# Altium schematic sheet connections.SchDoc
size A4; SheetNumber: 4; SheetTotal: 4
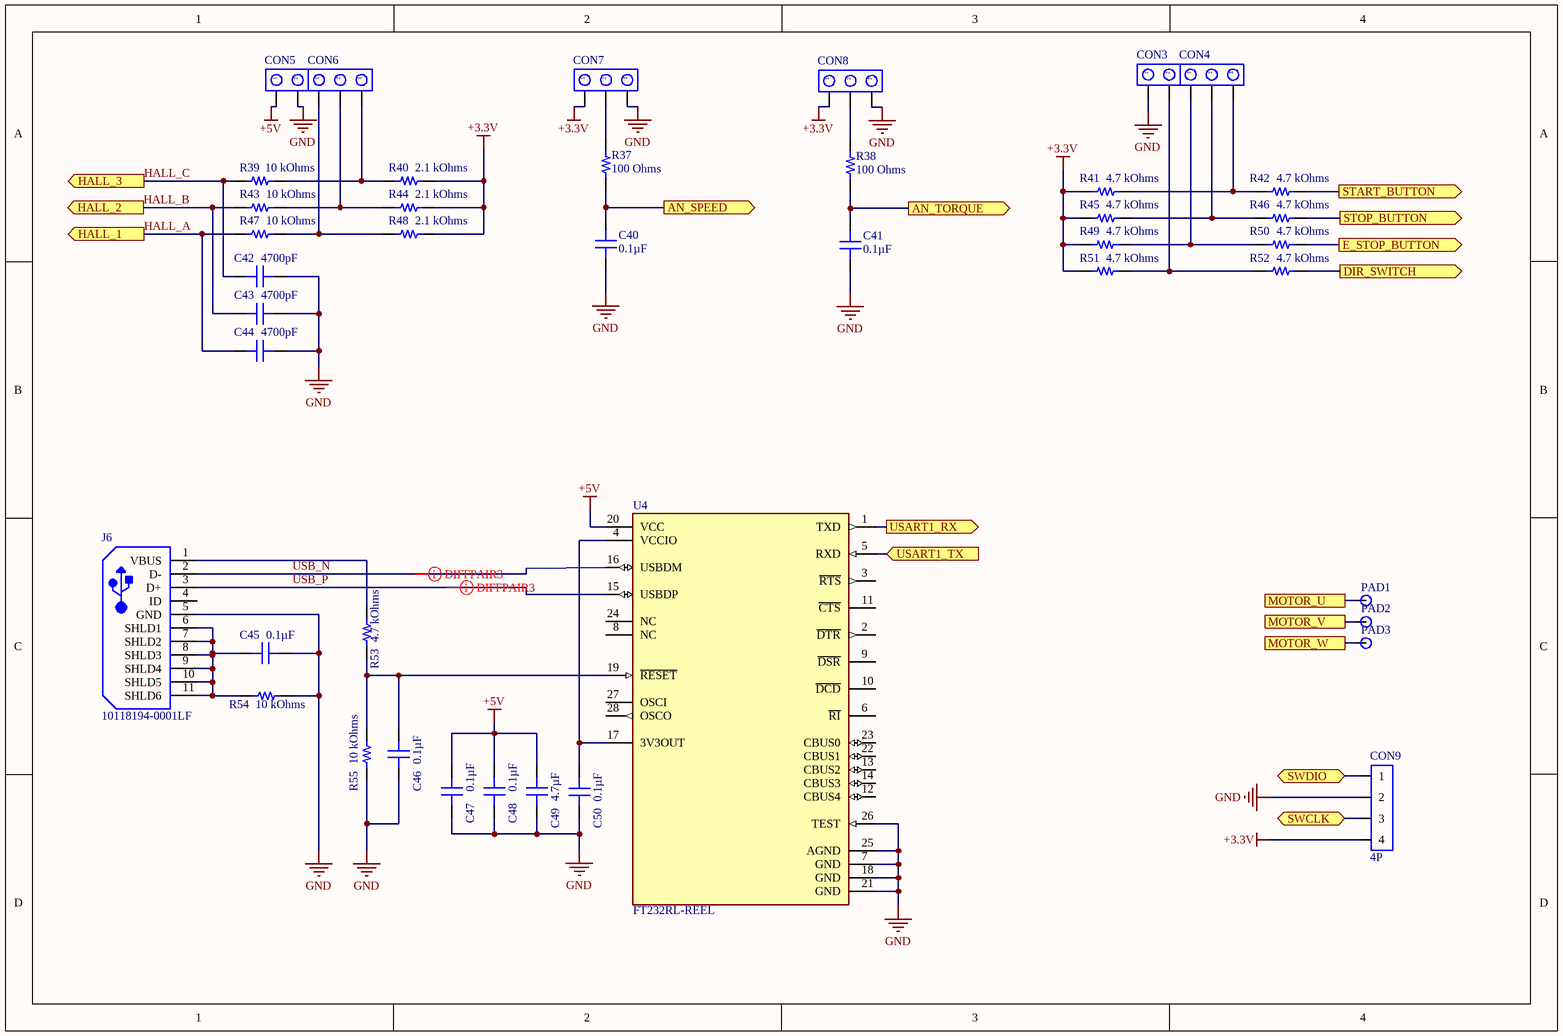
[diagram p0: connections.SchDoc]

## Parts
C40  0.1µF  [CAP 0402_1005]
C41  0.1µF  [CAP 0402_1005]
C42  4700pF  [CAP 0603_1608]
C43  4700pF  [CAP 0603_1608]
C44  4700pF  [CAP 0603_1608]
C45  0.1µF  [CAP 0402_1005]
C46  0.1µF  [CAP 0402_1005]
C47  0.1µF  [CAP 0402_1005]
C48  0.1µF  [CAP 0402_1005]
C49  4.7µF  [CAP 1206_3216 - 1.0MM]
C50  0.1µF  [CAP 0402_1005]
CON3  DG301-5.0-02P-12-00AH  [DG301-5.0-02P-12-00AH]  (value not drawn)
CON4  DG301-5.0-03P-12-00AH  [DG301-5.0-03P-12-00AH]  (value not drawn)
CON5  DG301-5.0-02P-12-00AH  [DG301-5.0-02P-12-00AH]  (value not drawn)
CON6  DG301-5.0-03P-12-00AH  [DG301-5.0-03P-12-00AH]  (value not drawn)
CON7  DG301-5.0-03P-12-00AH  [DG301-5.0-03P-12-00AH]  (value not drawn)
CON8  DG301-5.0-03P-12-00AH  [DG301-5.0-03P-12-00AH]  (value not drawn)
CON9  4P  [Single_THT_4P_2.54Pitch_6Height_180C]
J6  10118194-0001LF  [FCI-10118194-0001LF-5_V]
PAD1  Single Pad 4mm  [PCBComponent_1]  (value not drawn)
PAD2  Single Pad 4mm  [PCBComponent_1]  (value not drawn)
PAD3  Single Pad 4mm  [PCBComponent_1]  (value not drawn)
R37  100 Ohms  [RES 1206_3216]
R38  100 Ohms  [RES 1206_3216]
R39  10 kOhms  [RES 1206_3216]
R40  2.1 kOhms  [RES 1206_3216]
R41  4.7 kOhms  [RES 1206_3216]
R42  4.7 kOhms  [RES 1206_3216]
R43  10 kOhms  [RES 1206_3216]
R44  2.1 kOhms  [RES 1206_3216]
R45  4.7 kOhms  [RES 1206_3216]
R46  4.7 kOhms  [RES 1206_3216]
R47  10 kOhms  [RES 1206_3216]
R48  2.1 kOhms  [RES 1206_3216]
R49  4.7 kOhms  [RES 1206_3216]
R50  4.7 kOhms  [RES 1206_3216]
R51  4.7 kOhms  [RES 1206_3216]
R52  4.7 kOhms  [RES 1206_3216]
R53  4.7 kOhms  [RES 1206_3216]
R54  10 kOhms  [RES 1206_3216]
R55  10 kOhms  [RES 1206_3216]
U4  FT232RL-REEL  [FP-SSOP-28-IPC_B]

## Ports
AN_SPEED (out), AN_TORQUE (out), DIR_SWITCH (out), E_STOP_BUTTON (out), HALL_1 (out), HALL_2 (out), HALL_3 (out), MOTOR_U, MOTOR_V, MOTOR_W, START_BUTTON (out), STOP_BUTTON (out), SWCLK (bidir), SWDIO (bidir), USART1_RX (out), USART1_TX (in)

## Nets
+3.3V: CON7.1 CON8.1 CON9.4 R40.1 R41.1 R44.1 R45.1 R48.1 R49.1 R51.1
+5V: C47.2 C48.2 C49.2 CON5.1 U4.20(VCC)
GND: C40.1 C41.1 C42.1 C43.1 C44.1 C45.1 C46.1 C47.1 C48.1 C49.1 C50.1 CON3.1 CON5.2 CON7.3 CON8.3 CON9.2 J6.5(GND) R54.1 R55.1 U4.7(GND) U4.18(GND) U4.21(GND) U4.25(AGND) U4.26(TEST)
AN_SPEED: C40.2 R37.1 ; port AN_SPEED
AN_TORQUE: C41.2 R38.1 ; port AN_TORQUE
DIR_SWITCH: R52.2 ; port DIR_SWITCH
E_STOP_BUTTON: R50.2 ; port E_STOP_BUTTON
HALL_A: C44.2 R47.2 ; port HALL_1
HALL_B: C43.2 R43.2 ; port HALL_2
HALL_C: C42.2 R39.2 ; port HALL_3
MOTOR_U: PAD1.1 ; port MOTOR_U
MOTOR_V: PAD2.1 ; port MOTOR_V
MOTOR_W: PAD3.1 ; port MOTOR_W
START_BUTTON: R42.2 ; port START_BUTTON
STOP_BUTTON: R46.2 ; port STOP_BUTTON
SWCLK: CON9.3 ; port SWCLK
SWDIO: CON9.1 ; port SWDIO
USART1_RX: U4.1(TXD) ; port USART1_RX
USART1_TX: U4.5(RXD) ; port USART1_TX
USB_N: J6.2(D-) U4.16(USBDM)
USB_P: J6.3(D+) U4.15(USBDP)
NetC45_2: C45.2 J6.6(SHLD1) J6.7(SHLD2) J6.8(SHLD3) J6.9(SHLD4) J6.10(SHLD5) J6.11(SHLD6) R54.2
NetC46_2: C46.2 R53.1 R55.2 U4.19(~{RESET})
NetC50_2: C50.2 U4.4(VCCIO) U4.17(3V3OUT)
NetCON3_2: CON3.2 R51.2 R52.1
NetCON4_1: CON4.1 R49.2 R50.1
NetCON4_2: CON4.2 R45.2 R46.1
NetCON4_3: CON4.3 R41.2 R42.1
NetCON6_1: CON6.1 R47.1 R48.2
NetCON6_2: CON6.2 R43.1 R44.2
NetCON6_3: CON6.3 R39.1 R40.2
NetCON7_2: CON7.2 R37.2
NetCON8_2: CON8.2 R38.2
NetJ6_1: J6.1(VBUS) R53.2

Not connected (* = marked no-connect by the designer): J6 4(ID); U4 2(~{DTR}) 3(~{RTS}) 6(~{RI}) 8(NC) 9(~{DSR}) 10(~{DCD}) 11(~{CTS}) 12(CBUS4) 13(CBUS2) 14(CBUS3) 22(CBUS1) 23(CBUS0) 24(NC) 27(OSCI) 28(OSCO)

## Layout directives
differential pair; differential pair class USB: USB_N, USB_P

## Library data of the parts
C40 C41 C45-C48 C50 = C0402C104M4RACTU: CAP CER 0.1UF 16V X7R 0402; Manufacturer: KEMET; Tolerance: ±20%; Part Number: C0402C104M4RACTU; Value: 0.1µF; Applications: Bypass, Decoupling; Capacitance: 0.1µF; ComponentLink1Description: Datasheet; ComponentLink1URL: https://api.kemet.com/component-edge/download/datasheet/C0402C104M4RACTU.pdf; ComponentLink2Description: DigiKey Link; ComponentLink2URL: http://digikey.com/product-detail/en/kemet/C0402C104M4RACTU/399-7763-1-ND/3471486; Device Package: 0402 (1005 Metric); LastUpdated: 9/2/2020 1:02:24 AM; Lifecycle Status: Active; Minimum Order: 1; Mounting Type: Surface Mount, MLCC; Operating Temperature: -55°C ~ 125°C; Package / Case: 0402 (1005 Metric); Packaging: TapeAndReel; PartId: 2095; Part Status: Active; Price: 0.02; Series: SMD Comm X7R; Size / Dimension: 0.039" L x 0.020" W (1.00mm x 0.50mm); Supplier 1: DigiKey; Supplier Part Number 1: 399-7763-1-ND; Temperature Coefficient: X7R; Thickness (Max): 0.022" (0.55mm); Voltage - Rated: 16V
C42-C44 = C0603C472K4RECAUTO: CAP CER 0603 4.7NF 16V X7R 10%; Manufacturer: KEMET; Part Number: C0603C472K4RECAUTO; Value: 4700pF; Applications: Automotive, ESD Protection; Capacitance: 4700pF; ComponentLink1Description: Datasheet; ComponentLink1URL: https://api.kemet.com/component-edge/download/datasheet/C0603C472K4RECAUTO.pdf; ComponentLink2Description: DigiKey Link; ComponentLink2URL: http://digikey.com/product-detail/en/kemet/C0603C472K4RECAUTO/399-17879-1-ND/8640546; Device Package: 0603 (1608 Metric); LastUpdated: 9/2/2020 1:03:03 AM; Lifecycle Status: Active; Minimum Order: 1; Mounting Type: Surface Mount, MLCC; Operating Temperature: -55°C ~ 125°C; Package / Case: 0603 (1608 Metric); Packaging: TapeAndReel; PartId: 17340; Part Status: Active; Price: 0.03; Ratings: AEC-Q200; Series: ESD SMD Auto X7R; Size / Dimension: 0.063" L x 0.031" W (1.60mm x 0.80mm); Supplier 1: DigiKey; Supplier Part Number 1: 399-17879-1-ND; Temperature Coefficient: X7R; Thickness (Max): 0.034" (0.87mm); Tolerance: ±10%; Voltage - Rated: 16V
C49 = C3216X7R1E475K085AB: CAP CER 4.7UF 25V X7R 1206; Manufacturer: TDK Corporation; Tolerance: ±10%; Part Number: C3216X7R1E475K085AB; Value: 4.7µF; Applications: General Purpose; Capacitance: 4.7µF; ComponentLink1Description: Datasheet; ComponentLink1URL: https://product.tdk.com/info/en/catalog/datasheets/mlcc_commercial_general_en.pdf?ref_disty=digikey; ComponentLink2Description: DigiKey Link; ComponentLink2URL: http://digikey.com/product-detail/en/tdk-corporation/C3216X7R1E475K085AB/445-14797-1-ND/3956463; Device Package: 1206 (3216 Metric); Features: Low ESL; LastUpdated: 9/2/2020 1:05:06 AM; Lifecycle Status: Active; Minimum Order: 1; Mounting Type: Surface Mount, MLCC; Operating Temperature: -55°C ~ 125°C; Package / Case: 1206 (3216 Metric); Packaging: TapeAndReel; PartId: 19105; Part Status: Active; Price: 0.08; Series: C; Size / Dimension: 0.126" L x 0.063" W (3.20mm x 1.60mm); Supplier 1: DigiKey; Supplier Part Number 1: 445-14797-1-ND; Temperature Coefficient: X7R; Thickness (Max): 0.039" (1.00mm); Voltage - Rated: 25V
CON9 = Single 4P 2.54mm
J6 = KLS1-238: Micro USB B Type Receptacle, 1.8 A, -55 to 85 degC, 5-Pin SMD, RoHS, Tape and Reel; Manufacturer: Amphenol FCI; Body Orientation: RightAngle; Number of Contacts: 5; Pitch: 0.65mm; Gender: RCP; Rad Hard: No; Package Reference: 10118194-0001LF-5; Mounting: SurfaceMount; Manufacturer URL: http://www.fci.com/; Packaging: CutTape; Datasheet URL: https://datasheet.ciiva.com/26945/getdatasheetpartid-418619-26945695.pdf; Termination Method: Solder; Package Description: 5-Pin Surface Mount Device, Body 8.05 x 5.53 mm, Pitch 0.65 mm; Type: MicroUSBTypeB; Datasheet Version: Rev. A, 10/2011
R37 R38 = CRG1206F100R: RES SMD 100 OHM 1% 1/4W 1206; Manufacturer: TE Connectivity Passive Product; Power (Watts): 0.25W, 1/4W; Temperature Coefficient: ±200ppm/°C; Part Number: CRG1206F100R; ComponentLink1Description: Datasheet; ComponentLink1URL: https://www.te.com/commerce/DocumentDelivery/DDEController?Action=srchrtrv&DocNm=1773204&DocType=DS&DocLang=English; ComponentLink2Description: DigiKey Link; ComponentLink2URL: http://digikey.com/product-detail/en/te-connectivity-passive-product/CRG1206F100R/A106068CT-ND/3477719; Composition: Thick Film; Device Package: 1206 (3216 Metric); Height - Seated (Max): 0.026" (0.65mm); LastUpdated: 9/2/2020 1:13:10 AM; Lifecycle Status: Active; Minimum Order: 1; Number of Terminations: 2; Operating Temperature: -55°C ~ 155°C; Package / Case: 1206 (3216 Metric); Packaging: TapeAndReel; PartId: 26991; Part Status: Active; Price: 0.01; Resistance: 100 Ohms; Series: CRG, Neohm; Size / Dimension: 0.122" L x 0.061" W (3.10mm x 1.55mm); Supplier 1: DigiKey; Supplier Part Number 1: A106068CT-ND; Supplier Device Package: 1206; Tolerance: ±1%; Value: 100 Ohms
R39 R43 R47 R54 R55 = CRG1206F10K: RES SMD 10K OHM 1% 1/4W 1206; Manufacturer: TE Connectivity Passive Product; Power (Watts): 0.25W, 1/4W; Temperature Coefficient: ±100ppm/°C; Part Number: CRG1206F10K; ComponentLink1Description: Datasheet; ComponentLink1URL: https://www.te.com/commerce/DocumentDelivery/DDEController?Action=srchrtrv&DocNm=1773204&DocType=DS&DocLang=English; ComponentLink2Description: DigiKey Link; ComponentLink2URL: http://digikey.com/product-detail/en/te-connectivity-passive-product/CRG1206F10K/A106069CT-ND/3477720; Composition: Thick Film; Device Package: 1206 (3216 Metric); Height - Seated (Max): 0.026" (0.65mm); LastUpdated: 9/2/2020 1:13:10 AM; Lifecycle Status: Active; Minimum Order: 1; Number of Terminations: 2; Operating Temperature: -55°C ~ 155°C; Package / Case: 1206 (3216 Metric); Packaging: TapeAndReel; PartId: 26989; Part Status: Active; Price: 0.01; Resistance: 10 kOhms; Series: CRG, Neohm; Size / Dimension: 0.122" L x 0.061" W (3.10mm x 1.55mm); Supplier 1: DigiKey; Supplier Part Number 1: A106069CT-ND; Supplier Device Package: 1206; Tolerance: ±1%; Value: 10 kOhms
R40 R44 R48 = RC1206FR-072K1L: RES SMD 2.1K OHM 1% 1/4W 1206; Manufacturer: Yageo; Power (Watts): 0.25W, 1/4W; Temperature Coefficient: ±100ppm/°C; Part Number: RC1206FR-072K1L; ComponentLink1Description: Datasheet; ComponentLink1URL: https://www.yageo.com/upload/media/product/productsearch/datasheet/rchip/PYu-RC_Group_51_RoHS_L_10.pdf; ComponentLink2Description: DigiKey Link; ComponentLink2URL: http://digikey.com/product-detail/en/yageo/RC1206FR-072K1L/311-2.10KFRCT-ND/731565; Composition: Thick Film; Device Package: 1206 (3216 Metric); Features: Moisture Resistant; Height - Seated (Max): 0.026" (0.65mm); LastUpdated: 9/2/2020 1:12:56 AM; Lifecycle Status: Active; Minimum Order: 1; Number of Terminations: 2; Operating Temperature: -55°C ~ 155°C; Package / Case: 1206 (3216 Metric); Packaging: TapeAndReel; PartId: 32511; Part Status: Active; Price: 0.01; Resistance: 2.1 kOhms; Series: RC; Size / Dimension: 0.122" L x 0.063" W (3.10mm x 1.60mm); Supplier 1: DigiKey; Supplier Part Number 1: 311-2.10KFRCT-ND; Supplier Device Package: 1206; Tolerance: ±1%; Value: 2.1 kOhms
R41 R42 R45 R46 R49-R53 = CRG1206F4K7: RES SMD 4.7K OHM 1% 1/4W 1206; Manufacturer: TE Connectivity Passive Product; Power (Watts): 0.25W, 1/4W; Temperature Coefficient: ±100ppm/°C; Part Number: CRG1206F4K7; ComponentLink1Description: Datasheet; ComponentLink1URL: https://www.te.com/commerce/DocumentDelivery/DDEController?Action=srchrtrv&DocNm=1773204&DocType=DS&DocLang=English; ComponentLink2Description: DigiKey Link; ComponentLink2URL: http://digikey.com/product-detail/en/te-connectivity-passive-product/CRG1206F4K7/A106078CT-ND/3477735; Composition: Thick Film; Device Package: 1206 (3216 Metric); Height - Seated (Max): 0.026" (0.65mm); LastUpdated: 9/2/2020 1:13:10 AM; Lifecycle Status: Active; Minimum Order: 1; Number of Terminations: 2; Operating Temperature: -55°C ~ 155°C; Package / Case: 1206 (3216 Metric); Packaging: TapeAndReel; PartId: 26987; Part Status: Active; Price: 0.01; Resistance: 4.7 kOhms; Series: CRG, Neohm; Size / Dimension: 0.122" L x 0.061" W (3.10mm x 1.55mm); Supplier 1: DigiKey; Supplier Part Number 1: A106078CT-ND; Supplier Device Package: 1206; Tolerance: ±1%; Value: 4.7 kOhms
U4 = FT232R: IC USB FS SERIAL UART 28-SSOP; Data Rate: 12Mbps; Max Supply Voltage: 5.25V; Operating Supply Current: 15mA; Number of Channels: 1; Voltage: 5V; Min Supply Voltage: 3.3V; Radiation Hardening: No; Mount: Surface Mount; Min Operating Temperature: -40°C; Package Quantity: 2000; Number of Transceivers: 1; Width: 5.3mm; Number of Pins: 28; Height: 1.75mm; Weight: 0.080001oz; Lead Free: Lead Free; Length: 10.2mm; REACH SVHC: No SVHC; Max Operating Temperature: 85°C; Packaging: Tape and Reel; Interface: UART; Case/Package: SSOP